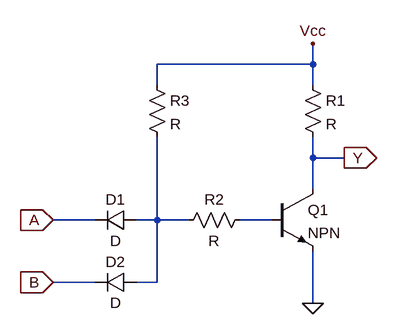
[diagram p0: schematic NAND.asc]
NAND.asc, the LTspice schematic file:
Version 4
SHEET 1 880 680
WIRE 288 -96 288 -128
WIRE 288 -96 48 -96
WIRE 48 -64 48 -96
WIRE 288 -64 288 -96
WIRE 288 48 288 16
WIRE 336 48 288 48
WIRE 288 96 288 48
WIRE -48 144 -112 144
WIRE 48 144 48 16
WIRE 48 144 16 144
WIRE 96 144 48 144
WIRE 224 144 176 144
WIRE -48 240 -112 240
WIRE 48 240 48 144
WIRE 48 240 16 240
WIRE 288 272 288 192
FLAG -112 144 A
IOPIN -112 144 In
FLAG -112 240 B
IOPIN -112 240 In
FLAG 336 48 Y
IOPIN 336 48 Out
FLAG 288 272 0
FLAG 288 -128 Vcc
SYMBOL npn 224 96 R0
SYMATTR InstName Q1
SYMBOL res 272 -80 R0
SYMATTR InstName R1
SYMBOL res 192 128 R90
WINDOW 0 0 56 VBottom 2
WINDOW 3 32 56 VTop 2
SYMATTR InstName R2
SYMBOL diode 16 128 R90
WINDOW 0 0 32 VBottom 2
WINDOW 3 32 32 VTop 2
SYMATTR InstName D1
SYMBOL diode 16 224 R90
WINDOW 0 0 32 VBottom 2
WINDOW 3 32 32 VTop 2
SYMATTR InstName D2
SYMBOL res 32 -80 R0
SYMATTR InstName R3

The netlist it stands for:
* NAND.asc
Q1 Y N002 0 0 NPN
R1 Vcc Y R
R2 N002 N001 R
D1 N001 A D
D2 N001 B D
R3 Vcc N001 R
.model D D
.lib standard.dio
.model NPN NPN
.model PNP PNP
.lib standard.bjt
.backanno
.end